# EAGLE schematic carterasp cobracasses 2 v3-1 (EAGLE 9.6.2)
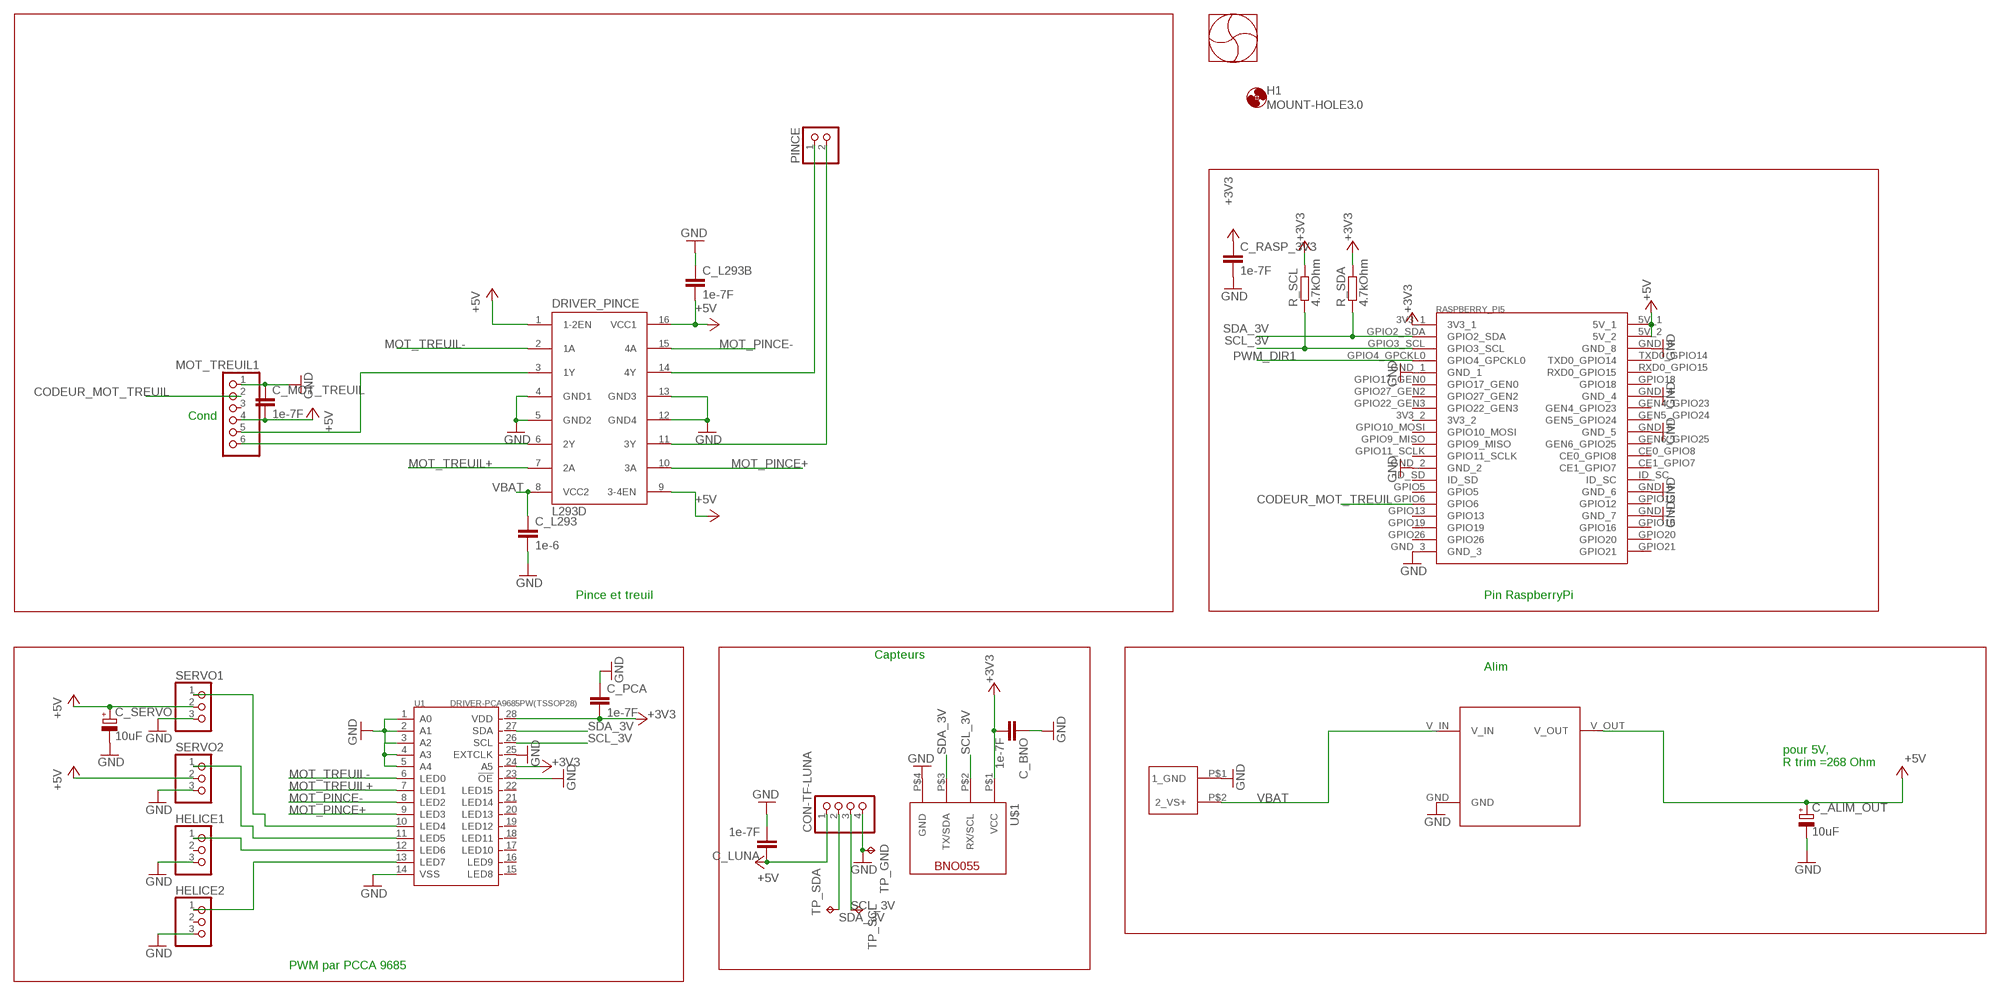
[diagram p0: schematic, sheet 1]

## Parts
C_ALIM_OUT  10uF  CPOL-EUE5-8.5  [E5-8,5]
C_BNO  1e-7F  C-EUC1206  [C1206]
C_L293  1e-6  C-EUC1206  [C1206]
C_L293B  1e-7F  C-EUC1206  [C1206]
C_LUNA  1e-7F  C-EUC1206  [C1206]
C_MOT_TREUIL  1e-7F  C-EUC1206  [C1206]
C_PCA  1e-7F  C-EUC1206  [C1206]
C_RASP_3V3  1e-7F  C-EUC1206  [C1206]
C_SERVO  10uF  CPOL-EUE5-8.5  [E5-8,5]
CON-TF-LUNA  PINHD-1X4  [1X04]
DRIVER_PINCE  L293D  [DIL16]
H1  MOUNT-HOLE3.0  [3,0]
HELICE1  PINHD-1X3  [1X03]
HELICE2  PINHD-1X3  [1X03]
MOT_TREUIL1  PINHD-1X6  [1X06]
PINCE  PINHD-1X2  [1X02]
R_SCL  4.7kOhm  R-EU_R0805  [R0805]
R_SDA  4.7kOhm  R-EU_R0805  [R0805]
SERVO1  PINHD-1X3  [1X03]
SERVO2  PINHD-1X3  [1X03]
TP_GND  TPPAD1-13  [P1-13]
TP_SCL  TPPAD1-13  [P1-13]
TP_SDA  TPPAD1-13  [P1-13]
U1  DRIVER-PCA9685PW(TSSOP28)  [TSSOP28-0.65-9.7X4.4MM]
U$1  MODULE_BNO055  [MODULE_BNO055]
U$2  CONN_ALIM  [CONN_ALIM]
U$3  RASPBERRY_PI5  [RP5]
U$4  OKL_T6_W12  [OKL_T6_W12]
U$5  VENTILLATEUR_RASP  [VENTILLATEUR_RASP]

## Nets
+3V3: C_BNO.2 C_PCA.2 C_RASP_3V3.1 R_SCL.2 R_SDA.2 U1.24(A5) U1.28(VDD) U$1.P$1(VCC) U$3.3V3_1
+5V: C_ALIM_OUT.+ C_L293B.2 C_LUNA.1 C_MOT_TREUIL.2 C_SERVO.+ CON-TF-LUNA.1 DRIVER_PINCE.1(1-2EN) DRIVER_PINCE.9(3-4EN) DRIVER_PINCE.16(VCC1) MOT_TREUIL1.4 SERVO1.2 SERVO2.2 U$3.5V_1 U$3.5V_2 U$4.V_OUT
CODEUR_MOT_TREUIL: MOT_TREUIL1.2 U$3.GPIO6
GND: C_ALIM_OUT.- C_BNO.1 C_L293.2 C_L293B.1 C_LUNA.2 C_MOT_TREUIL.1 C_PCA.1 C_RASP_3V3.2 C_SERVO.- CON-TF-LUNA.4 DRIVER_PINCE.4(GND1) DRIVER_PINCE.5(GND2) DRIVER_PINCE.12(GND4) DRIVER_PINCE.13(GND3) HELICE1.3 HELICE2.3 MOT_TREUIL1.1 SERVO1.3 SERVO2.3 TP_GND.TP U1.1(A0) U1.2(A1) U1.3(A2) U1.4(A3) U1.5(A4) U1.14(VSS) U1.23(!OE) U1.25(EXTCLK) U$1.P$4(GND) U$2.P$1(1_GND) U$3.GND_1 U$3.GND_2 U$3.GND_3 U$3.GND_4 U$3.GND_5 U$3.GND_6 U$3.GND_7 U$3.GND_8 U$4.GND
MOT_PINCE+: DRIVER_PINCE.10(3A) U1.9(LED3)
MOT_PINCE-: DRIVER_PINCE.15(4A) U1.8(LED2)
MOT_TREUIL+: DRIVER_PINCE.7(2A) U1.7(LED1)
MOT_TREUIL-: DRIVER_PINCE.2(1A) U1.6(LED0)
N$4: DRIVER_PINCE.3(1Y) MOT_TREUIL1.5
N$6: DRIVER_PINCE.14(4Y) PINCE.1
N$8: SERVO1.1 U1.10(LED4)
N$9: SERVO2.1 U1.11(LED5)
N$10: HELICE1.1 U1.12(LED6)
N$11: HELICE2.1 U1.13(LED7)
N$12: DRIVER_PINCE.11(3Y) PINCE.2
N$15: DRIVER_PINCE.6(2Y) MOT_TREUIL1.6
PWM_DIR1: U$3.GPIO4_GPCKL0
SCL_3V: CON-TF-LUNA.3 R_SCL.1 TP_SCL.TP U1.26(SCL) U$1.P$2(RX/SCL) U$3.GPIO3_SCL
SDA_3V: CON-TF-LUNA.2 R_SDA.1 TP_SDA.TP U1.27(SDA) U$1.P$3(TX/SDA) U$3.GPIO2_SDA
VBAT: C_L293.1 DRIVER_PINCE.8(VCC2) U$2.P$2(2_VS+) U$4.V_IN
Unconnected: HELICE1.2 HELICE2.2 MOT_TREUIL1.3 U1.15(LED8) U1.16(LED9) U1.17(LED10) U1.18(LED11) U1.19(LED12) U1.20(LED13) U1.21(LED14) U1.22(LED15) U$3.3V3_2 U$3.CE0_GPIO8 U$3.CE1_GPIO7 U$3.GEN4_GPIO23 U$3.GEN5_GPIO24 U$3.GEN6_GPIO25 U$3.GPIO5 U$3.GPIO9_MISO U$3.GPIO10_MOSI U$3.GPIO11_SCLK U$3.GPIO12 U$3.GPIO13 U$3.GPIO16 U$3.GPIO17_GEN0 U$3.GPIO18 U$3.GPIO19 U$3.GPIO20 U$3.GPIO21 U$3.GPIO22_GEN3 U$3.GPIO26 U$3.GPIO27_GEN2 U$3.ID_SC U$3.ID_SD U$3.RXD0_GPIO15 U$3.TXD0_GPIO14

## Notes on the sheet
- Cond
- Pince et treuil | Pin RaspberryPi
- Capteurs
- Alim
- pour 5V, 
  R trim =268 Ohm
- PWM par PCCA 9685

## Library data of the parts
C_ALIM_OUT C_SERVO = rcl:CPOL-EU: POLARIZED CAPACITOR, European symbol
C_BNO C_L293 C_L293B C_LUNA C_MOT_TREUIL C_PCA C_RASP_3V3 = rcl:C-EU: CAPACITOR, European symbol
CON-TF-LUNA = pinhead:PINHD-1X4: PIN HEADER
DRIVER_PINCE = st-microelectronics:L293D: PUSH-PULL 4 CHANNEL DRIVER; MPN: L293D; OC_FARNELL: 9589619; OC_NEWARK: 56P8249
H1 = holes:MOUNT-HOLE: MOUNTING HOLE with drill center marker
HELICE1 HELICE2 SERVO1 SERVO2 = pinhead:PINHD-1X3: PIN HEADER
MOT_TREUIL1 = pinhead:PINHD-1X6: PIN HEADER
PINCE = pinhead:PINHD-1X2: PIN HEADER
R_SCL R_SDA = rcl:R-EU_: RESISTOR, European symbol
TP_GND TP_SCL TP_SDA = testpad:TP: Test pad
U1 = DRIVER-PCA9685PW_TSSOP28_:DRIVER-PCA9685PW(TSSOP28): Check availability <https://pricing.snapeda.com/parts/PCA9685PW/NXP%20USA/view-part?ref=eda>; AVAILABILITY: In Stock; CHECK_PRICES: https://www.snapeda.com/parts/PCA9685PW/NXP+Semiconductors/view-part/?ref=eda; DESCRIPTION: LED Driver IC 16 Output Linear - PWM Dimming 25mA 28-TSSOP; MF: NXP USA; MP: PCA9685PW; PACKAGE: None; PRICE: None; SNAPEDA_LINK: https://www.snapeda.com/parts/PCA9685PW/NXP+Semiconductors/view-part/?ref=snap
U$1 = lib_ens_aj_v1:MODULE_BNO055
U$2 = lib_ens_aj_v1:CONN_ALIM
U$3 = shadokos_lib_raspberry:RASPBERRY_PI5
U$4 = shadokos_lib_raspberry:OKL_T6_W12: OKL_T6_W12 monté sur le coté
U$5 = shadokos_lib_raspberry:VENTILLATEUR_RASP